# Altium schematic sheet HDMI.SchDoc
size 593 x 419 mm; SheetNumber: 2; SheetTotal: 3
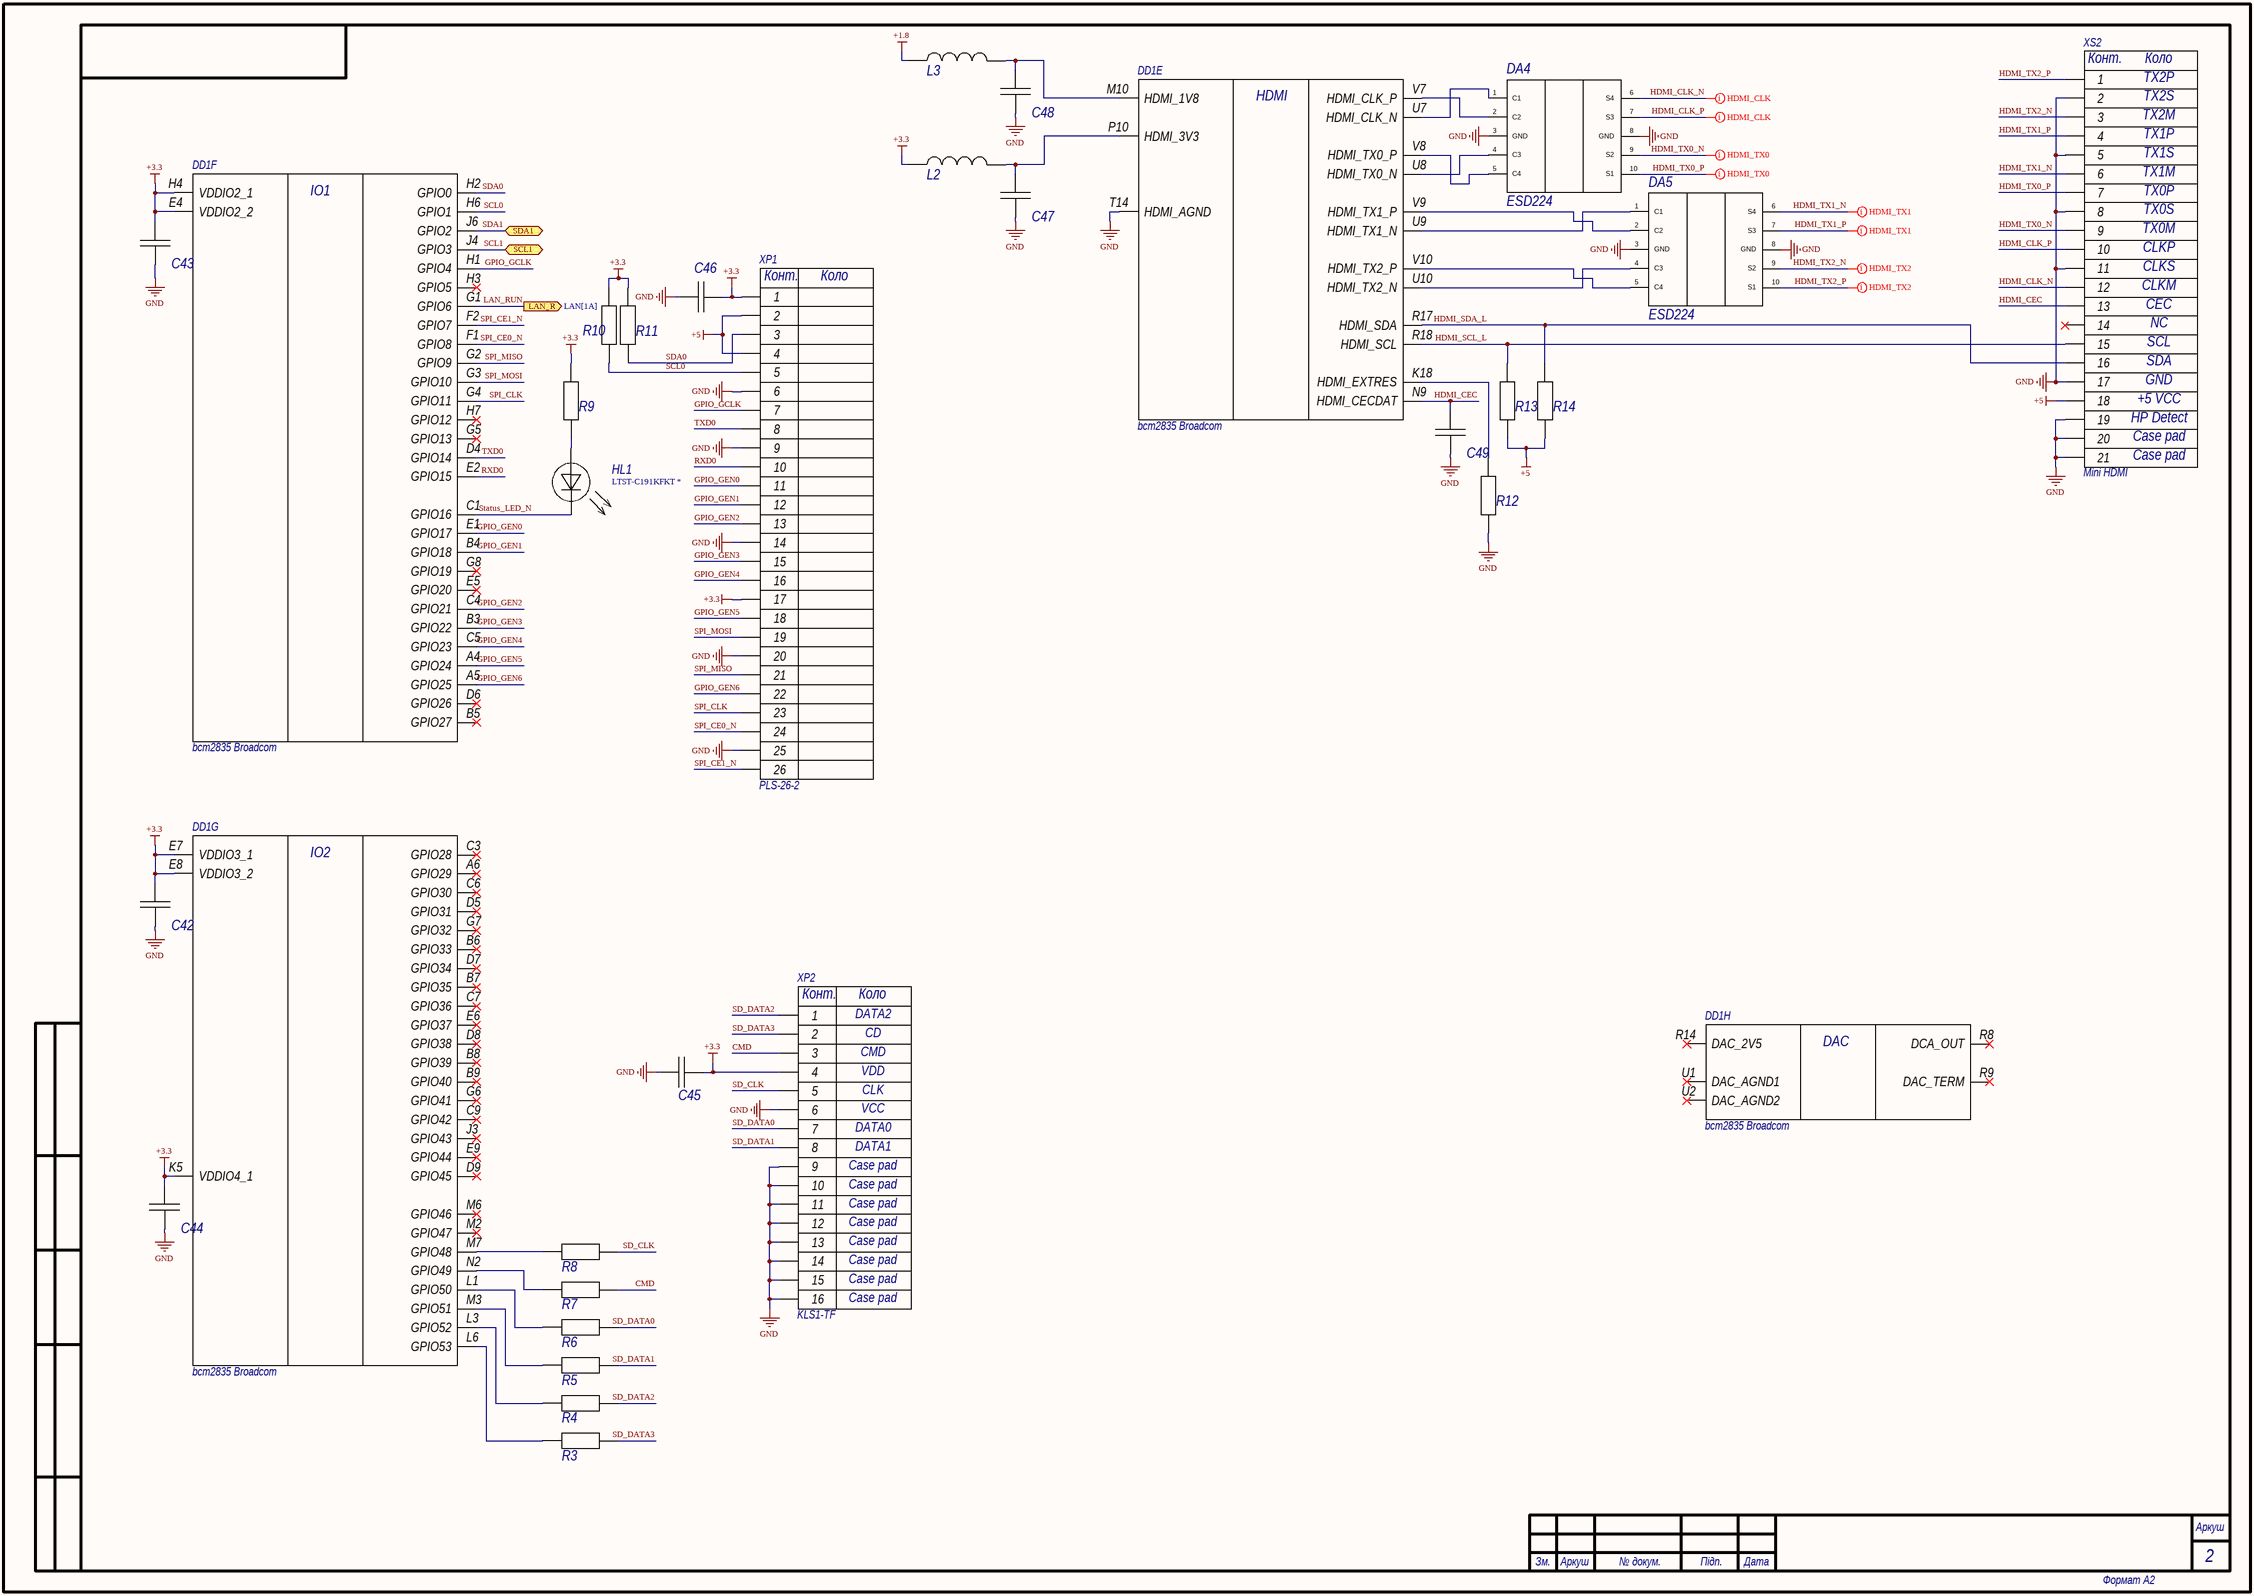
[diagram p0: HDMI.SchDoc]

## Parts
C42  C-0603 * * * * *  [С-0603]  (value not drawn)
C43  C-0603 * * * * *  [С-0603]  (value not drawn)
C44  C-0603 * * * * *  [С-0603]  (value not drawn)
C45  C-0603 * * * * *  [С-0603]  (value not drawn)
C46  C-0603 * * * * *  [С-0603]  (value not drawn)
C47  C-0805 * * * * *  [C-0805-KEM]  (value not drawn)
C48  C-0805 * * * * *  [C-0805-KEM]  (value not drawn)
C49  C-0402 * * * * *  [C-0402]  (value not drawn)
DA4  ESD224 *  [DQA0010A]  (value not drawn)
DA5  ESD224 *  [DQA0010A]  (value not drawn)
DD1  bcm2835 Broadcom  [BGA81C65P18X18_1200X1200]  (parts E,F,G,H of 16)
HL1  LTST-C191KFKT *  [LED_DIALIGHT_598_DIA]
L2  R-0402 * * * *  [FB-0805]  (value not drawn)
L3  R-0402 * * * *  [FB-0805]  (value not drawn)
R3  R-0603 * * * *  [R-0603]  (value not drawn)
R4  R-0603 * * * *  [R-0603]  (value not drawn)
R5  R-0603 * * * *  [R-0603]  (value not drawn)
R6  R-0603 * * * *  [R-0603]  (value not drawn)
R7  R-0603 * * * *  [R-0603]  (value not drawn)
R8  R-0603 * * * *  [R-0603]  (value not drawn)
R9  R-0603 * * * *  [R-0603]  (value not drawn)
R10  R-0402 * * * *  [R-0402]  (value not drawn)
R11  R-0402 * * * *  [R-0402]  (value not drawn)
R12  R-0402 * * * *  [R-0402]  (value not drawn)
R13  R-0402 * * * *  [R-0402]  (value not drawn)
R14  R-0402 * * * *  [R-0402]  (value not drawn)
XP1  PLS-26-2  [26 pin 2.54mm pitch 2 row]
XP2  KLS1-TF  [504077-1891_MOL]
XS2  Mini HDMI  [mini HDMI]

## Ports
LAN_R (out, see LAN[1A]), SCL1 (bidir), SDA1 (bidir)

## Nets
+1.8: L3.1
+3.3: C42.1 C43.2 C44.1 C45.1 C46.2 DD1.E4(VDDIO2_2) DD1.E7(VDDIO3_1) DD1.E8(VDDIO3_2) DD1.H4(VDDIO2_1) DD1.K5(VDDIO4_1) L2.1 R9.2 R10.2 R11.2 XP1.1 XP1.17 XP2.4
+5: R13.2 R14.2 XP1.2 XP1.4 XS2.18
GND: C42.2 C43.1 C44.2 C45.2 C46.1 C47.2 C48.2 C49.1 DA4.3(GND) DA4.8(GND) DA5.3(GND) DA5.8(GND) DD1.T14(HDMI_AGND) R12.1 XP1.6 XP1.9 XP1.14 XP1.20 XP1.25 XP2.6 XP2.9 XP2.10 XP2.11 XP2.12 XP2.13 XP2.14 XP2.15 XP2.16 XS2.2 XS2.5 XS2.8 XS2.11 XS2.17 XS2.19 XS2.20 XS2.21
CMD: R7.2 XP2.3
GPIO_GCLK: DD1.H1(GPIO4) XP1.7
GPIO_GEN0: DD1.E1(GPIO17) XP1.11
GPIO_GEN1: DD1.B4(GPIO18) XP1.12
GPIO_GEN2: DD1.C4(GPIO21) XP1.13
GPIO_GEN3: DD1.B3(GPIO22) XP1.15
GPIO_GEN4: DD1.C5(GPIO23) XP1.16
GPIO_GEN5: DD1.A4(GPIO24) XP1.18
GPIO_GEN6: DD1.A5(GPIO25) XP1.22
HDMI_CEC: C49.2 DD1.N9(HDMI_CECDAT) XS2.13
HDMI_CLK_N: DA4.6(S4) XS2.12
HDMI_CLK_P: DA4.7(S3) XS2.10
HDMI_SCL_L: DD1.R18(HDMI_SCL) R13.1 XS2.15
HDMI_SDA_L: DD1.R17(HDMI_SDA) R14.1 XS2.16
HDMI_TX0_N: DA4.9(S2) XS2.9
HDMI_TX0_P: DA4.10(S1) XS2.7
HDMI_TX1_N: DA5.6(S4) XS2.6
HDMI_TX1_P: DA5.7(S3) XS2.4
HDMI_TX2_N: DA5.9(S2) XS2.3
HDMI_TX2_P: DA5.10(S1) XS2.1
LAN_RUN: DD1.G1(GPIO6) ; port LAN_R
RXD0: DD1.E2(GPIO15) XP1.10
SCL0: DD1.H6(GPIO1) R10.1 XP1.5
SCL1: DD1.J4(GPIO3) ; port SCL1
SD_CLK: R8.2 XP2.5
SD_DATA0: R6.2 XP2.7
SD_DATA1: R5.2 XP2.8
SD_DATA2: R4.2 XP2.1
SD_DATA3: R3.2 XP2.2
SDA0: DD1.H2(GPIO0) R11.1 XP1.3
SDA1: DD1.J6(GPIO2) ; port SDA1
SPI_CE0_N: DD1.F1(GPIO8) XP1.24
SPI_CE1_N: DD1.F2(GPIO7) XP1.26
SPI_CLK: DD1.G4(GPIO11) XP1.23
SPI_MISO: DD1.G2(GPIO9) XP1.21
SPI_MOSI: DD1.G3(GPIO10) XP1.19
Status_LED_N: DD1.C1(GPIO16) HL1.2
TXD0: DD1.D4(GPIO14) XP1.8
NetC47_1: C47.1 DD1.P10(HDMI_3V3) L2.2
NetC48_1: C48.1 DD1.M10(HDMI_1V8) L3.2
NetDA4_1: DA4.1(C1) DD1.U7(HDMI_CLK_N)
NetDA4_2: DA4.2(C2) DD1.V7(HDMI_CLK_P)
NetDA4_4: DA4.4(C3) DD1.U8(HDMI_TX0_N)
NetDA4_5: DA4.5(C4) DD1.V8(HDMI_TX0_P)
NetDA5_1: DA5.1(C1) DD1.U9(HDMI_TX1_N)
NetDA5_2: DA5.2(C2) DD1.V9(HDMI_TX1_P)
NetDA5_4: DA5.4(C3) DD1.U10(HDMI_TX2_N)
NetDA5_5: DA5.5(C4) DD1.V10(HDMI_TX2_P)
NetDD1_K18: DD1.K18(HDMI_EXTRES) R12.2
NetDD1_L1: DD1.L1(GPIO50) R6.1
NetDD1_L3: DD1.L3(GPIO52) R4.1
NetDD1_L6: DD1.L6(GPIO53) R3.1
NetDD1_M3: DD1.M3(GPIO51) R5.1
NetDD1_M7: DD1.M7(GPIO48) R8.1
NetDD1_N2: DD1.N2(GPIO49) R7.1
NetHL1_1: HL1.1 R9.1

Not connected (* = marked no-connect by the designer): DD1 A6(GPIO29)* B5(GPIO27)* B6(GPIO33)* B7(GPIO35)* B8(GPIO39)* B9(GPIO40)* C3(GPIO28)* C6(GPIO30)* C7(GPIO36)* C9(GPIO42)* D5(GPIO31)* D6(GPIO26)* D7(GPIO34)* D8(GPIO38)* D9(GPIO45)* E5(GPIO20)* E6(GPIO37)* E9(GPIO44)* G5(GPIO13)* G6(GPIO41)* G7(GPIO32)* G8(GPIO19)* H3(GPIO5)* H7(GPIO12)* J3(GPIO43)* M2(GPIO47)* M6(GPIO46)* R8(DCA_OUT)* R9(DAC_TERM)* R14(DAC_2V5)* U1(DAC_AGND1)* U2(DAC_AGND2)*; XS2 14*

## Layout directives
differential pair: HDMI_CLK_N, HDMI_CLK_P, HDMI_TX0_N, HDMI_TX0_P, HDMI_TX1_N, HDMI_TX1_P, HDMI_TX2_N, HDMI_TX2_P

## Notes on the sheet
- Аркуш
- Зм.
- № докум.
- Підп.
- Дата
- Формат А2
- (in symbol bcm2835, part E) HDMI
- (in symbol bcm2835, part F) IO1
- (in symbol bcm2835, part G) IO2
- (in symbol bcm2835, part H) DAC
- (in symbol kls1-tf) Конт.; Коло; DATA2; CD; CMD; VDD; CLK; VCC; DATA0; DATA1; Case pad
- (in symbol Mini HDMI) Конт.; Коло; TX2P; TX2S; TX2M; TX1P; TX1S; TX1M; TX0P; TX0S; TX0M; CLKP; CLKS; CLKM; CEC; NC; SCL; SDA; GND; +5 VCC; HP Detect; Case pad
- (in symbol PLS-26-2) Конт.; Коло

## Library data of the parts
C42-C46 = С-0603: Generic; Manufacturer: *; Tolerance: *; Package: C-0603; Temp_Coef: *; Voltage: *; Value: *
C47 C48 = С-0805: Generic; Manufacturer: *; Tolerance: *; Package: C-0805; Temp_Coef: *; Voltage: *; Value: *
C49 = С-0402: Generic; Manufacturer: *; Tolerance: *; Package: C-0402; Temp_Coef: *; Voltage: *; Value: *
DA4 DA5 = ESD224: bav99 double diode; Manufacturer: *; Name: ESD224
DD1 = bcm2835: BCM2835 ARM-based processor; Manufacturer: Broadcom; Name: bcm2835
HL1 = LED 0603: Generic LED 0603; Manufacturer: *; Name: LTST-C191KFKT
L2 L3 = Ferrite Bead 0805: Generic; Manufacturer: *; Tolerance: *; Package: R-0402; Power: *; Value: *
R3-R9 = R-0603: Generic; Manufacturer: *; Tolerance: *; Package: R-0603; Power: *; Value: *
R10-R14 = R-0402: Generic; Manufacturer: *; Tolerance: *; Package: R-0402; Power: *; Value: *
XP1 = PLS-26-2: PLS connector 26 pin 2.54mm pitch 2 rows; Name: PLS-26-2
XP2 = kls1-tf: Micro-SD card connector SMT mounting; Name: kls1-tf
XS2 = Mini HDMI: Name: Mini HDMI